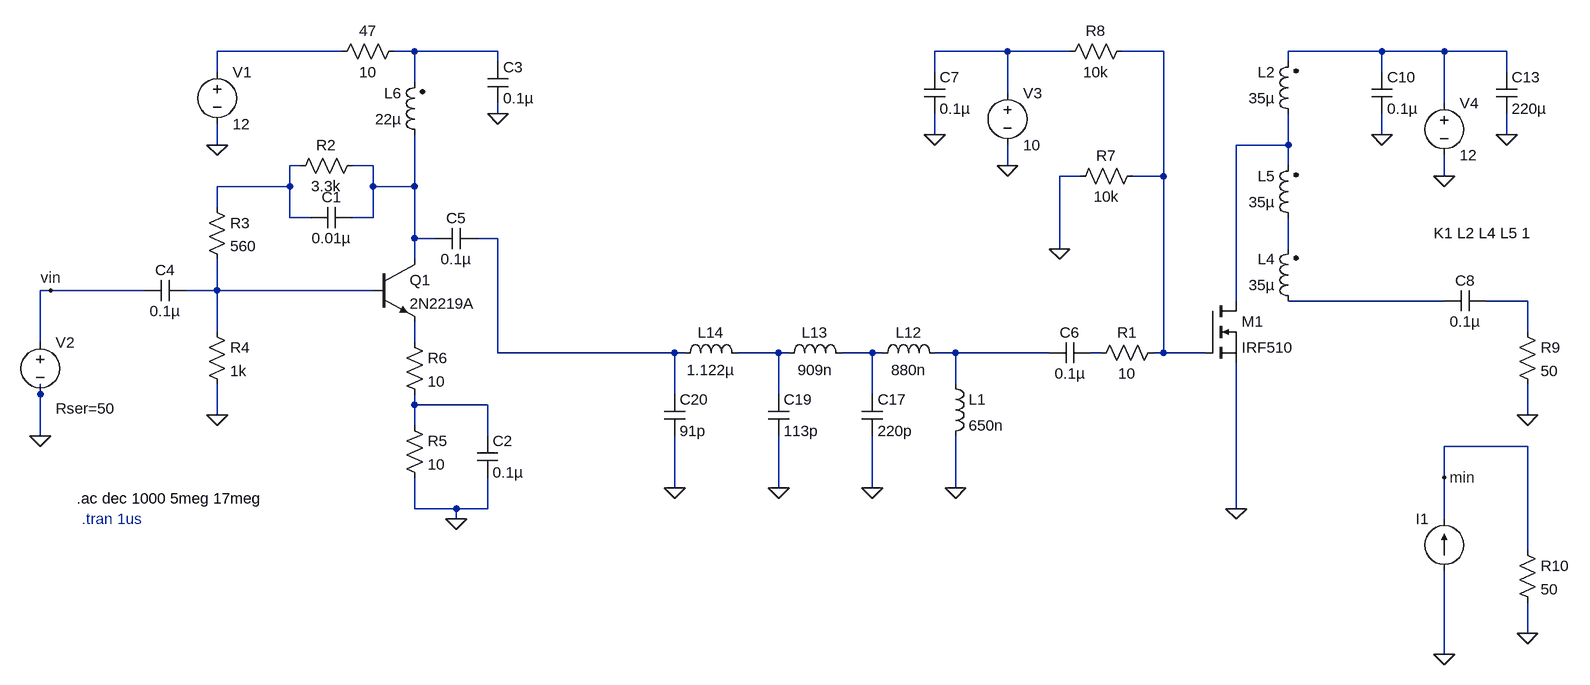
[diagram p0: schematic dsb_amp.asc]
dsb_amp.asc, the LTspice schematic file:
Version 4
SHEET 1 3812 1408
WIRE 448 64 256 64
WIRE 560 64 528 64
WIRE 688 64 560 64
WIRE 1472 64 1360 64
WIRE 1568 64 1472 64
WIRE 1712 64 1648 64
WIRE 2048 64 1904 64
WIRE 2144 64 2048 64
WIRE 2240 64 2144 64
WIRE 688 80 688 64
WIRE 1904 80 1904 64
WIRE 256 96 256 64
WIRE 1360 96 1360 64
WIRE 2048 96 2048 64
WIRE 2240 96 2240 64
WIRE 560 112 560 64
WIRE 1472 128 1472 64
WIRE 2144 144 2144 64
WIRE 688 160 688 144
WIRE 1360 192 1360 160
WIRE 2048 192 2048 160
WIRE 2240 192 2240 160
WIRE 256 208 256 176
WIRE 1904 208 1904 160
WIRE 1904 208 1824 208
WIRE 384 240 368 240
WIRE 496 240 464 240
WIRE 1472 240 1472 208
WIRE 1904 240 1904 208
WIRE 1584 256 1552 256
WIRE 1712 256 1712 64
WIRE 1712 256 1664 256
WIRE 2144 256 2144 224
WIRE 368 272 368 240
WIRE 368 272 256 272
WIRE 496 272 496 240
WIRE 560 272 560 192
WIRE 560 272 496 272
WIRE 256 304 256 272
WIRE 368 320 368 272
WIRE 400 320 368 320
WIRE 496 320 496 272
WIRE 496 320 464 320
WIRE 560 352 560 272
WIRE 592 352 560 352
WIRE 688 352 656 352
WIRE 1552 368 1552 256
WIRE 1904 368 1904 320
WIRE 560 384 560 352
WIRE 0 432 -16 432
WIRE 144 432 0 432
WIRE 256 432 256 384
WIRE 256 432 208 432
WIRE 496 432 256 432
WIRE 1824 448 1824 208
WIRE 2144 448 1904 448
WIRE 2272 448 2208 448
WIRE 256 496 256 432
WIRE 2272 496 2272 448
WIRE -16 512 -16 432
WIRE 560 512 560 480
WIRE 688 528 688 352
WIRE 960 528 688 528
WIRE 976 528 960 528
WIRE 1120 528 1056 528
WIRE 1136 528 1120 528
WIRE 1264 528 1216 528
WIRE 1280 528 1264 528
WIRE 1392 528 1360 528
WIRE 1536 528 1392 528
WIRE 1616 528 1600 528
WIRE 1712 528 1712 256
WIRE 1712 528 1696 528
WIRE 1776 528 1712 528
WIRE 1392 576 1392 528
WIRE -16 592 -16 576
WIRE 960 592 960 528
WIRE 1120 592 1120 528
WIRE 1264 592 1264 528
WIRE 560 608 560 592
WIRE 672 608 560 608
WIRE 256 624 256 576
WIRE 2272 624 2272 576
WIRE 560 640 560 608
WIRE -16 656 -16 592
WIRE 672 656 672 608
WIRE 2272 672 2144 672
WIRE 2144 720 2144 672
WIRE 960 736 960 656
WIRE 1120 736 1120 656
WIRE 1264 736 1264 656
WIRE 1392 736 1392 656
WIRE 560 768 560 720
WIRE 624 768 560 768
WIRE 672 768 672 720
WIRE 672 768 624 768
WIRE 1824 768 1824 544
WIRE 624 784 624 768
WIRE 2144 784 2144 720
WIRE 2272 832 2272 672
WIRE 2272 960 2272 912
WIRE 2144 992 2144 864
FLAG 256 208 0
FLAG 256 624 0
FLAG 624 784 0
FLAG 1472 240 0
FLAG 2144 256 0
FLAG 1824 768 0
FLAG 2048 192 0
FLAG 688 160 0
FLAG -16 656 0
FLAG 1360 192 0
FLAG 1552 368 0
FLAG 2240 192 0
FLAG 0 432 vin
FLAG 2272 624 0
FLAG 1264 736 0
FLAG 1120 736 0
FLAG 960 736 0
FLAG 1392 736 0
FLAG 2144 992 0
FLAG 2144 720 min
FLAG 2272 960 0
SYMBOL voltage 256 80 R0
SYMATTR InstName V1
SYMATTR Value 12
SYMBOL res 544 48 R90
WINDOW 0 0 56 VBottom 2
WINDOW 3 32 56 VTop 2
SYMATTR InstName 47
SYMATTR Value 10
SYMBOL npn 496 384 R0
SYMATTR InstName Q1
SYMATTR Value 2N2219A
SYMBOL res 480 224 R90
WINDOW 0 0 56 VBottom 2
WINDOW 3 32 56 VTop 2
SYMATTR InstName R2
SYMATTR Value 3.3k
SYMBOL cap 464 304 R90
WINDOW 0 0 32 VBottom 2
WINDOW 3 32 32 VTop 2
SYMATTR InstName C1
SYMATTR Value 0.01µ
SYMBOL res 240 288 R0
SYMATTR InstName R3
SYMATTR Value 560
SYMBOL res 240 480 R0
SYMATTR InstName R4
SYMATTR Value 1k
SYMBOL cap 208 416 R90
WINDOW 0 0 32 VBottom 2
WINDOW 3 32 32 VTop 2
SYMATTR InstName C4
SYMATTR Value 0.1µ
SYMBOL voltage 1472 112 R0
SYMATTR InstName V3
SYMATTR Value 10
SYMBOL nmos 1776 448 R0
SYMATTR InstName M1
SYMATTR Value IRF510
SYMBOL cap 2208 432 R90
WINDOW 0 0 32 VBottom 2
WINDOW 3 32 32 VTop 2
SYMATTR InstName C8
SYMATTR Value 0.1µ
SYMBOL voltage 2144 128 R0
SYMATTR InstName V4
SYMATTR Value 12
SYMBOL ind2 1920 464 R180
WINDOW 0 36 80 Left 2
WINDOW 3 36 40 Left 2
SYMATTR InstName L4
SYMATTR Value 35µ
SYMATTR Type ind
SYMBOL ind2 1920 336 R180
WINDOW 0 36 80 Left 2
WINDOW 3 36 40 Left 2
SYMATTR InstName L5
SYMATTR Value 35µ
SYMATTR Type ind
SYMBOL cap 2032 96 R0
SYMATTR InstName C10
SYMATTR Value 0.1µ
SYMBOL ind2 1920 176 R180
WINDOW 0 36 80 Left 2
WINDOW 3 36 40 Left 2
SYMATTR InstName L2
SYMATTR Value 35µ
SYMATTR Type ind
SYMBOL cap 656 656 R0
SYMATTR InstName C2
SYMATTR Value 0.1µ
SYMBOL ind2 576 208 R180
WINDOW 0 36 80 Left 2
WINDOW 3 36 40 Left 2
SYMATTR InstName L6
SYMATTR Value 22µ
SYMATTR Type ind
SYMBOL cap 672 80 R0
SYMATTR InstName C3
SYMATTR Value 0.1µ
SYMBOL res 544 496 R0
SYMATTR InstName R6
SYMATTR Value 10
SYMBOL res 544 624 R0
SYMATTR InstName R5
SYMATTR Value 10
SYMBOL cap 1344 96 R0
SYMATTR InstName C7
SYMATTR Value 0.1µ
SYMBOL res 1680 240 R90
WINDOW 0 0 56 VBottom 2
WINDOW 3 32 56 VTop 2
SYMATTR InstName R7
SYMATTR Value 10k
SYMBOL res 1664 48 R90
WINDOW 0 0 56 VBottom 2
WINDOW 3 32 56 VTop 2
SYMATTR InstName R8
SYMATTR Value 10k
SYMBOL cap 2224 96 R0
SYMATTR InstName C13
SYMATTR Value 220µ
SYMBOL voltage -16 496 R0
WINDOW 3 24 96 Invisible 2
WINDOW 39 24 118 Left 2
SYMATTR Value SINE(0 300m 7000k)
SYMATTR SpiceLine Rser=50
SYMATTR InstName V2
SYMATTR Value2 AC 1
SYMBOL res 2256 480 R0
SYMATTR InstName R9
SYMATTR Value 50
SYMBOL res 1712 512 R90
WINDOW 0 0 56 VBottom 2
WINDOW 3 32 56 VTop 2
SYMATTR InstName R1
SYMATTR Value 10
SYMBOL cap 592 368 R270
WINDOW 0 32 32 VTop 2
WINDOW 3 0 32 VBottom 2
SYMATTR InstName C5
SYMATTR Value 0.1µ
SYMBOL cap 1536 544 R270
WINDOW 0 32 32 VTop 2
WINDOW 3 0 32 VBottom 2
SYMATTR InstName C6
SYMATTR Value 0.1µ
SYMBOL cap 1248 592 R0
SYMATTR InstName C17
SYMATTR Value 220p
SYMBOL ind 1264 544 R270
WINDOW 0 32 56 VTop 2
WINDOW 3 5 56 VBottom 2
SYMATTR InstName L12
SYMATTR Value 880n
SYMBOL cap 1104 592 R0
SYMATTR InstName C19
SYMATTR Value 113p
SYMBOL ind 1120 544 R270
WINDOW 0 32 56 VTop 2
WINDOW 3 5 56 VBottom 2
SYMATTR InstName L13
SYMATTR Value 909n
SYMBOL cap 944 592 R0
SYMATTR InstName C20
SYMATTR Value 91p
SYMBOL ind 960 544 R270
WINDOW 0 32 56 VTop 2
WINDOW 3 5 56 VBottom 2
SYMATTR InstName L14
SYMATTR Value 1.122µ
SYMBOL ind 1376 560 R0
SYMATTR InstName L1
SYMATTR Value 650n
SYMBOL current 2144 864 R180
WINDOW 0 24 80 Left 2
WINDOW 3 24 0 Left 2
SYMATTR InstName I1
SYMATTR Value ""
SYMATTR Value2 AC 1
SYMBOL res 2256 816 R0
SYMATTR InstName R10
SYMATTR Value 50
TEXT 40 752 Left 2 !.ac dec 1000 5meg 17meg
TEXT 48 784 Left 2 ;.tran 1us
TEXT 2128 344 Left 2 !K1 L2 L4 L5 1

The netlist it stands for:
* dsb_amp.asc
V1 N001 0 12
R§47 N002 N001 10
Q1 N008 N011 N014 0 2N2219A
R2 N008 N007 3.3k
C1 N008 N007 0.01µ
R3 N007 N011 560
R4 N011 0 1k
C4 N011 vin 0.1µ
V3 N003 0 10
M1 N006 N004 0 0 IRF510
C8 N013 N012 0.1µ
V4 N005 0 12
L4 N012 N010 35µ
L5 N010 N006 35µ
C10 N005 0 0.1µ
L2 N006 N005 35µ
C2 N019 0 0.1µ
L6 N008 N002 22µ
C3 N002 0 0.1µ
R6 N014 N019 10
R5 N019 0 10
C7 N003 0 0.1µ
R7 N004 0 10k
R8 N004 N003 10k
C13 N005 0 220µ
V2 vin 0 SINE(0 300m 7000k) AC 1 Rser=50
R9 N013 0 50
R1 N004 N018 10
C5 N008 N009 0.1µ
C6 N017 N018 0.1µ
C17 N016 0 220p
L12 N016 N017 880n
C19 N015 0 113p
L13 N015 N016 909n
C20 N009 0 91p
L14 N009 N015 1.122µ
L1 N017 0 650n
I1 0 min AC 1
R10 min 0 50
.model NPN NPN
.model PNP PNP
.lib standard.bjt
.model NMOS NMOS
.model PMOS PMOS
.lib standard.mos
.ac dec 1000 5meg 17meg
* .tran 1us
K1 L2 L4 L5 1
.backanno
.end